# Altium project Conveyer_MainBoard.PrjPcb
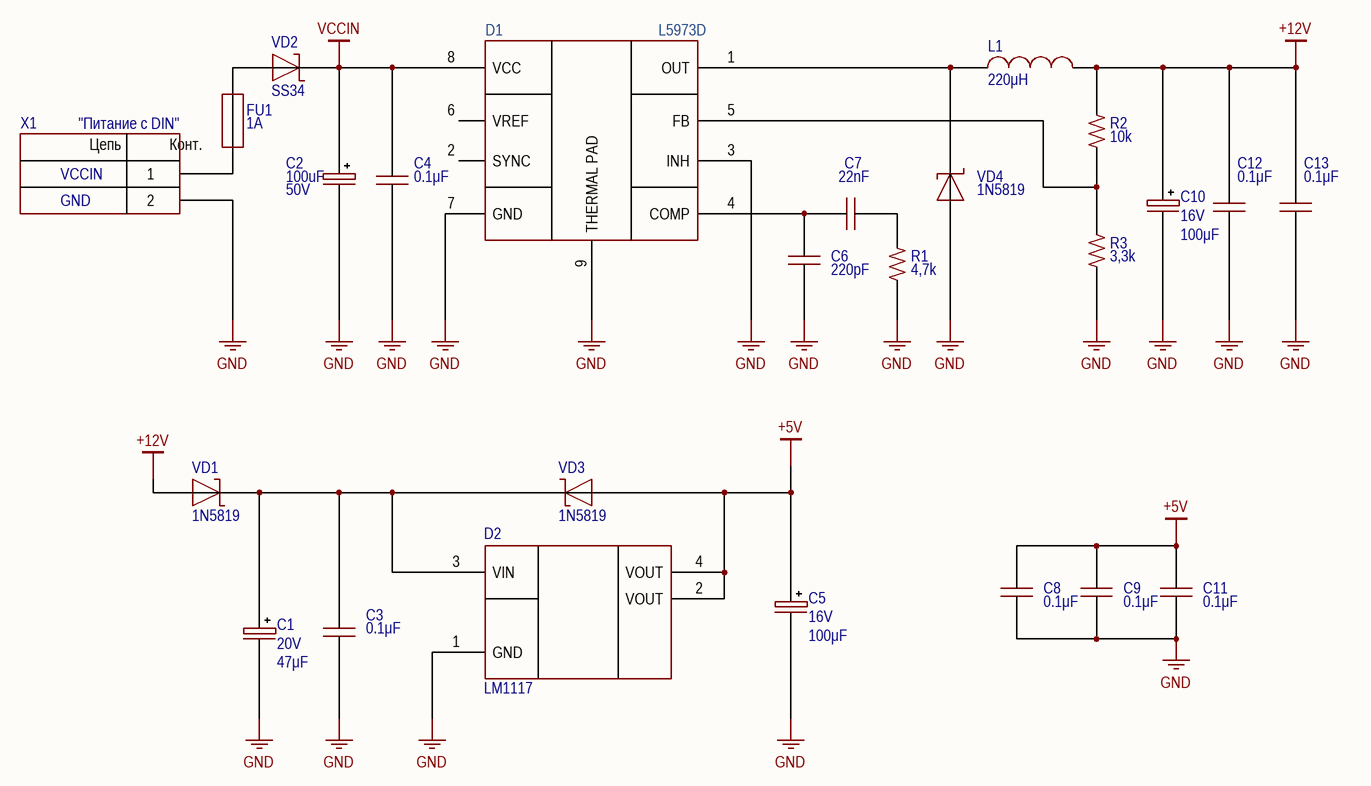
[diagram p0: Power.SchDoc]
3 sheets, 127 parts. Net scope: global (net labels, ports and power ports of the same name join across sheets).
Board file: PCB.PcbDoc
Sheets:
  Power.SchDoc
  Step_Driver.SchDoc
  Input.SchDoc

## Sheet Power.SchDoc
size 420 x 297 mm; Address1: Address1; Address2: Address2; Address3: Address3; Address4: Address4; DocumentNumber: АБВГ.123456.001 Э3; SheetNumber: 1; Scale: 1:1; DocumentType: Схема электрическая принципиальная; FirstReferrence: АБВГ.123456.001

### Parts
C1  Напряжение: 20V  Значение: 47μF  [CAP: TANTAL-D]
C2  value 100uF  Voltage: 50V  [CAP: SMD D8A6.9]
C3  value 0.1μF  [CAP: 0805]
C4  value 0.1μF  [CAP: 0805]
C5  Напряжение: 16V  Значение: 100μF  [CAP: TANTAL-D]
C6  value 220pF  [CAP: 0805]
C7  value 22nF  [CAP: 0805]
C8  value 0.1μF  [CAP: 0805]
C9  value 0.1μF  [CAP: 0805]
C10  Напряжение: 16V  Значение: 100μF  [CAP: TANTAL-D]
C11  value 0.1μF  [CAP: 0805]
C12  value 0.1μF  [CAP: 0805]
C13  value 0.1μF  [CAP: 0805]
D1  L5973D  [HSOIC-DDA-8]
D2  (no value)  [SOT223]
FU1  MaxCurrent: 1A  [FUSE: 1812]
L1  value 220μH  [IND: CD54]
R1  value 4,7k  [RES: 0805]
R2  value 10k  [RES: 0805]
R3  value 3,3k  [RES: 0805]
VD1  PartNumber: 1N5819  [DIODE: SOD123]
VD2  PartNumber: SS34  [DIODE: SMA]
VD3  PartNumber: 1N5819  [DIODE: SOD123]
VD4  PartNumber: 1N5819  [DIODE: SOD123]
X1  CommentText: "Питание с DIN"  [CON: 15EDGVC-3.5-02 (or 691321100002)]

### Nets
+5V: C5.1 C8.2 C9.2 C11.2 D2.2(VOUT) D2.4(VOUT) VD3.1
+12V: C10.1 C12.2 C13.2 L1.1 R2.1 VD1.1
GND: C1.2 C2.2 C3.1 C4.1 C5.2 C6.2 C8.1 C9.1 C10.2 C11.1 C12.1 C13.1 D1.3(INH) D1.7(GND) D1.9(THERMAL_PAD) D2.1(GND) R1.2 R3.2 VD4.1 X1.2
VCCIN: C2.1 C4.2 D1.8(VCC) VD2.2
NetC1_1: C1.1 C3.2 D2.3(VIN) VD1.2 VD3.2
NetC6_1: C6.1 C7.2 D1.4(COMP)
NetC7_1: C7.1 R1.1
NetD1_1: D1.1(OUT) L1.2 VD4.2
NetD1_5: D1.5(FB) R2.2 R3.1
NetFU1_1: FU1.1 X1.1
NetFU1_2: FU1.2 VD2.1

Not connected (* = marked no-connect by the designer): D1 2(SYNC) 6(VREF)

### Notes on the sheet
- GND
- VCCIN
- Перв. примен.
- Справ. №
- Подп. и дата
- Инв. № дубл.
- Взам. инв. №
- Разраб.
- Изм.
- Лист
- № докум.
- Подп.
- Дата
- Лит.
- Масса
- Масштаб
- Пров.
- Т.контр.
- Листов
- Инв. № подл.
- Утв.
- Н.контр.
- 2.106-A3
- Копировал
- Формат А3
- (in symbol Connector_terminal_2pin) Цепь; Конт.

### Library data of the parts
C1 C5 C10 = Танталы SMD: Производитель: AVX; УникальныйНомер: F930J107KAAAJ6; Типоразмер: Тип А (3216); Ссылка: ***; Точность: ±10%; ТипКомпонента: Tantalum capacitor
C2 = Aluminium: Manufacturer: Capxon International Elec; PartNumber: TH102M025I200ECAB; TypeCapacitor: Конденсатор электролитический алюминиевый SMD; Package: 13x20mm
C3 C8 C9 C11-C13 = Ceramic_0805: Manufacturer: Murata Electronics; PartNumber: GRM21BR71H104KA01L; ValueManufacturerPartNumber: Керамический конденсатор, 0.1μF, X7R, ±10%, 16V, 0805, -55...+125°C; TypeCapacitor: Керамический конденсатор; Tolerance: ±10%; TypeDielectric: X7R; Voltage: 16V; Package: 0805; HelpURL: https://www.digikey.com/product-detail/en/yageo/CC0805KRX7R7BB104/311-1142-1-ND/303052; Temperature: -55...+125°C
C4 = Ceramic_0805: Manufacturer: Murata Electronics; PartNumber: GRM21BR71H104KA01L; ValueManufacturerPartNumber: Керамический конденсатор, 0.1μF, X7R, ±10%, 50V, 0805, -55...+125°C; TypeCapacitor: Керамический конденсатор; Tolerance: ±10%; TypeDielectric: X7R; Voltage: 50V; Package: 0805; HelpURL: https://www.digikey.com/product-detail/en/yageo/CC0805KRX7R7BB104/311-1142-1-ND/303052; Temperature: -55...+125°C
C6 = Ceramic_0805: Manufacturer: Murata Electronics; PartNumber: GCJ21BR71H224KA01L; ValueManufacturerPartNumber: Керамический конденсатор, 220pF, X7R, ±10%, 16V, 0805, -55...+125°C; TypeCapacitor: Керамический конденсатор; Tolerance: ±10%; TypeDielectric: X7R; Voltage: 16V; Package: 0805; HelpURL: https://www.digikey.com/product-detail/en/yageo/CC0805KRX7R7BB104/311-1142-1-ND/303052; Temperature: -55...+125°C
C7 = Ceramic_0805: Manufacturer: Murata Electronics; PartNumber: GCM216R71H223KA37D; ValueManufacturerPartNumber: Керамический конденсатор, 22nF, X7R, ±10%, 16V, 0805, -55...+125°C; TypeCapacitor: Керамический конденсатор; Tolerance: ±10%; TypeDielectric: X7R; Voltage: 16V; Package: 0805; HelpURL: https://www.digikey.com/product-detail/en/yageo/CC0805KRX7R7BB104/311-1142-1-ND/303052; Temperature: -55...+125°C
D1 = L5973D: Импульсный понижающий регулятор напряжения; Manufacturer: STMicroelectronics; ValueManufacturerPartNumber: Импульсный понижающий регулятор напряжения, supply 10...30V, 500kHz, External switch, -40...+105°C, HSOP-8; PartNumber: L5973D013TR; VoltageInput: supply 10...30V; Frequency: 500kHz; OutputType: External switch; HelpURL: https://www.digikey.com/product-detail/en/on-semiconductor/UC3842BVD1R2G/UC3842BVD1R2GOSCT-ND/5802572; Package: HSOP-8; ComponentType: Импульсный понижающий регулятор напряжения; Temperature: -40...+105°C
D2 = LM1117: Линейный регулятор с низким падением напряжения; Manufacturer: STMicroelectronics; ValueManufacturerPartNumber: Линейный регулятор с низким падением напряжения, input 3.9...18V, 0.6V, output 3.3V, 1.2A, -40...+85°C, SOT223; VoltageInput: input 3.9...18V; MaxDropout: 0.6V; CurrentOutput: 1.2A; VoltageOutput: output 3.3V; HelpURL: ***; Package: SOT223; ComponentType: Линейный регулятор с низким падением напряжения; Temperature: -40...+85°C; PartNumber: LM1117
FU1 = Fuse: Manufacturer: Littelfuse; PartNumber: 0468001.NR; TypeFuse: Предохранитель SMD; VoltageMax: 250VAC; Package: 1206; HelpURL: https://www.digikey.com/products/en?keywords=01110501Z; ValueManufacturerPartNumber: =TypeFuse+', '+VoltageMax+', '+MaxCurrent+', '+Package+', '+Temperature
L1 = Inductor_CD54: Manufacturer: YJYCOIN; PartNumber: CD54YP0504-221M; ValueManufacturerPartNumber: Fixed inductor, 220μH, ±20%, CD54, 1.44A, -40...+100°C; TypeInductor: Fixed inductor; MaxCurrent: 1.44A; Tolerance: ±20%; Package: CD54; HelpURL: https://www.digikey.com/product-detail/en/sumida-america-components-inc/CD43NP-100MC/308-1855-1-ND/3925624; Temperature: -40...+100°C
R1 = Resistor_0805_ieee: Manufacturer: Vishay Intertech; PartNumber: CRCW08054K70JNEA; ValueManufacturerPartNumber: Резистор SMD, 4,7k, ±1%, 0805, 0.125W, -55...+125°C; TypeResistor: Резистор SMD; Power: 0.125W; Tolerance: ±1%; Package: 0805; HelpURL: https://www.digikey.com/product-detail/en/yageo/RC0805JR-07100RL/311-100ARCT-ND/731185; Temperature: -55...+125°C
R2 = Resistor_0805_ieee: Manufacturer: Vishay Intertech; PartNumber: CRCW080510K0FKEA; ValueManufacturerPartNumber: Резистор SMD, 10k, ±1%, 0805, 0.125W, -55...+125°C; TypeResistor: Резистор SMD; Power: 0.125W; Tolerance: ±1%; Package: 0805; HelpURL: https://www.digikey.com/product-detail/en/yageo/RC0805JR-07100RL/311-100ARCT-ND/731185; Temperature: -55...+125°C
R3 = Resistor_0805_ieee: Manufacturer: Vishay Intertech; ValueManufacturerPartNumber: Резистор SMD, 3,3k, ±1%, 0805, 0.125W, -55...+125°C; TypeResistor: Резистор SMD; Power: 0.125W; Tolerance: ±1%; PartNumber: Vishay Intertech; Package: 0805; HelpURL: https://www.digikey.com/product-detail/en/yageo/RC0805JR-07100RL/311-100ARCT-ND/731185; Temperature: -55...+125°C
VD1-VD3 = Schottky_single: Manufacturer: BORN; ValueManufacturerPartNumber: Диод Шоттки, 80V, 500mA, 1V, 15pF, SMA, -55...+150°C; TypeDiode: Диод Шоттки; Voltage: 80V; Current: 500mA; VoltageDrop: 1V; RecoveryTime: 15pF; Package: SMA; HelpURL: https://www.digikey.com/product-detail/en/diodes-incorporated/MBR0580S1-7/MBR0580S1-7DICT-ND/5080371; Temperature: -55...+150°C
VD4 = Schottky_single: Manufacturer: Diodes Incorporated; ValueManufacturerPartNumber: Диод Шоттки, 80V, 500mA, 1V, 15pF, SOD-123, -55...+150°C; TypeDiode: Диод Шоттки; Voltage: 80V; Current: 500mA; VoltageDrop: 1V; RecoveryTime: 15pF; Package: SOD-123; HelpURL: https://www.digikey.com/product-detail/en/diodes-incorporated/MBR0580S1-7/MBR0580S1-7DICT-ND/5080371; Temperature: -55...+150°C
X1 = Connector_terminal_2pin: Manufacturer: DEGSON; ValueManufacturerPartNumber: Клеммник, 2pin, 3.5mm, 300VAC, 10A; PartNumber: DG350-3.5-02P-14-00A(H); TypeConnector: Клеммник; VoltageMax: 300VAC; Pitch: 3.5mm; CurrentMax: 10A; Multichannel: 2pin; HelpURL: https://www.chipdip.ru/product/dg350-3.5-02p-12

## Sheet Step_Driver.SchDoc
size 420 x 297 mm; Address1: Address1; Address2: Address2; Address3: Address3; Address4: Address4; DocumentNumber: АБВГ.123456.001 Э3; SheetNumber: 1; Scale: 1:1; DocumentType: Схема электрическая принципиальная; FirstReferrence: АБВГ.123456.001
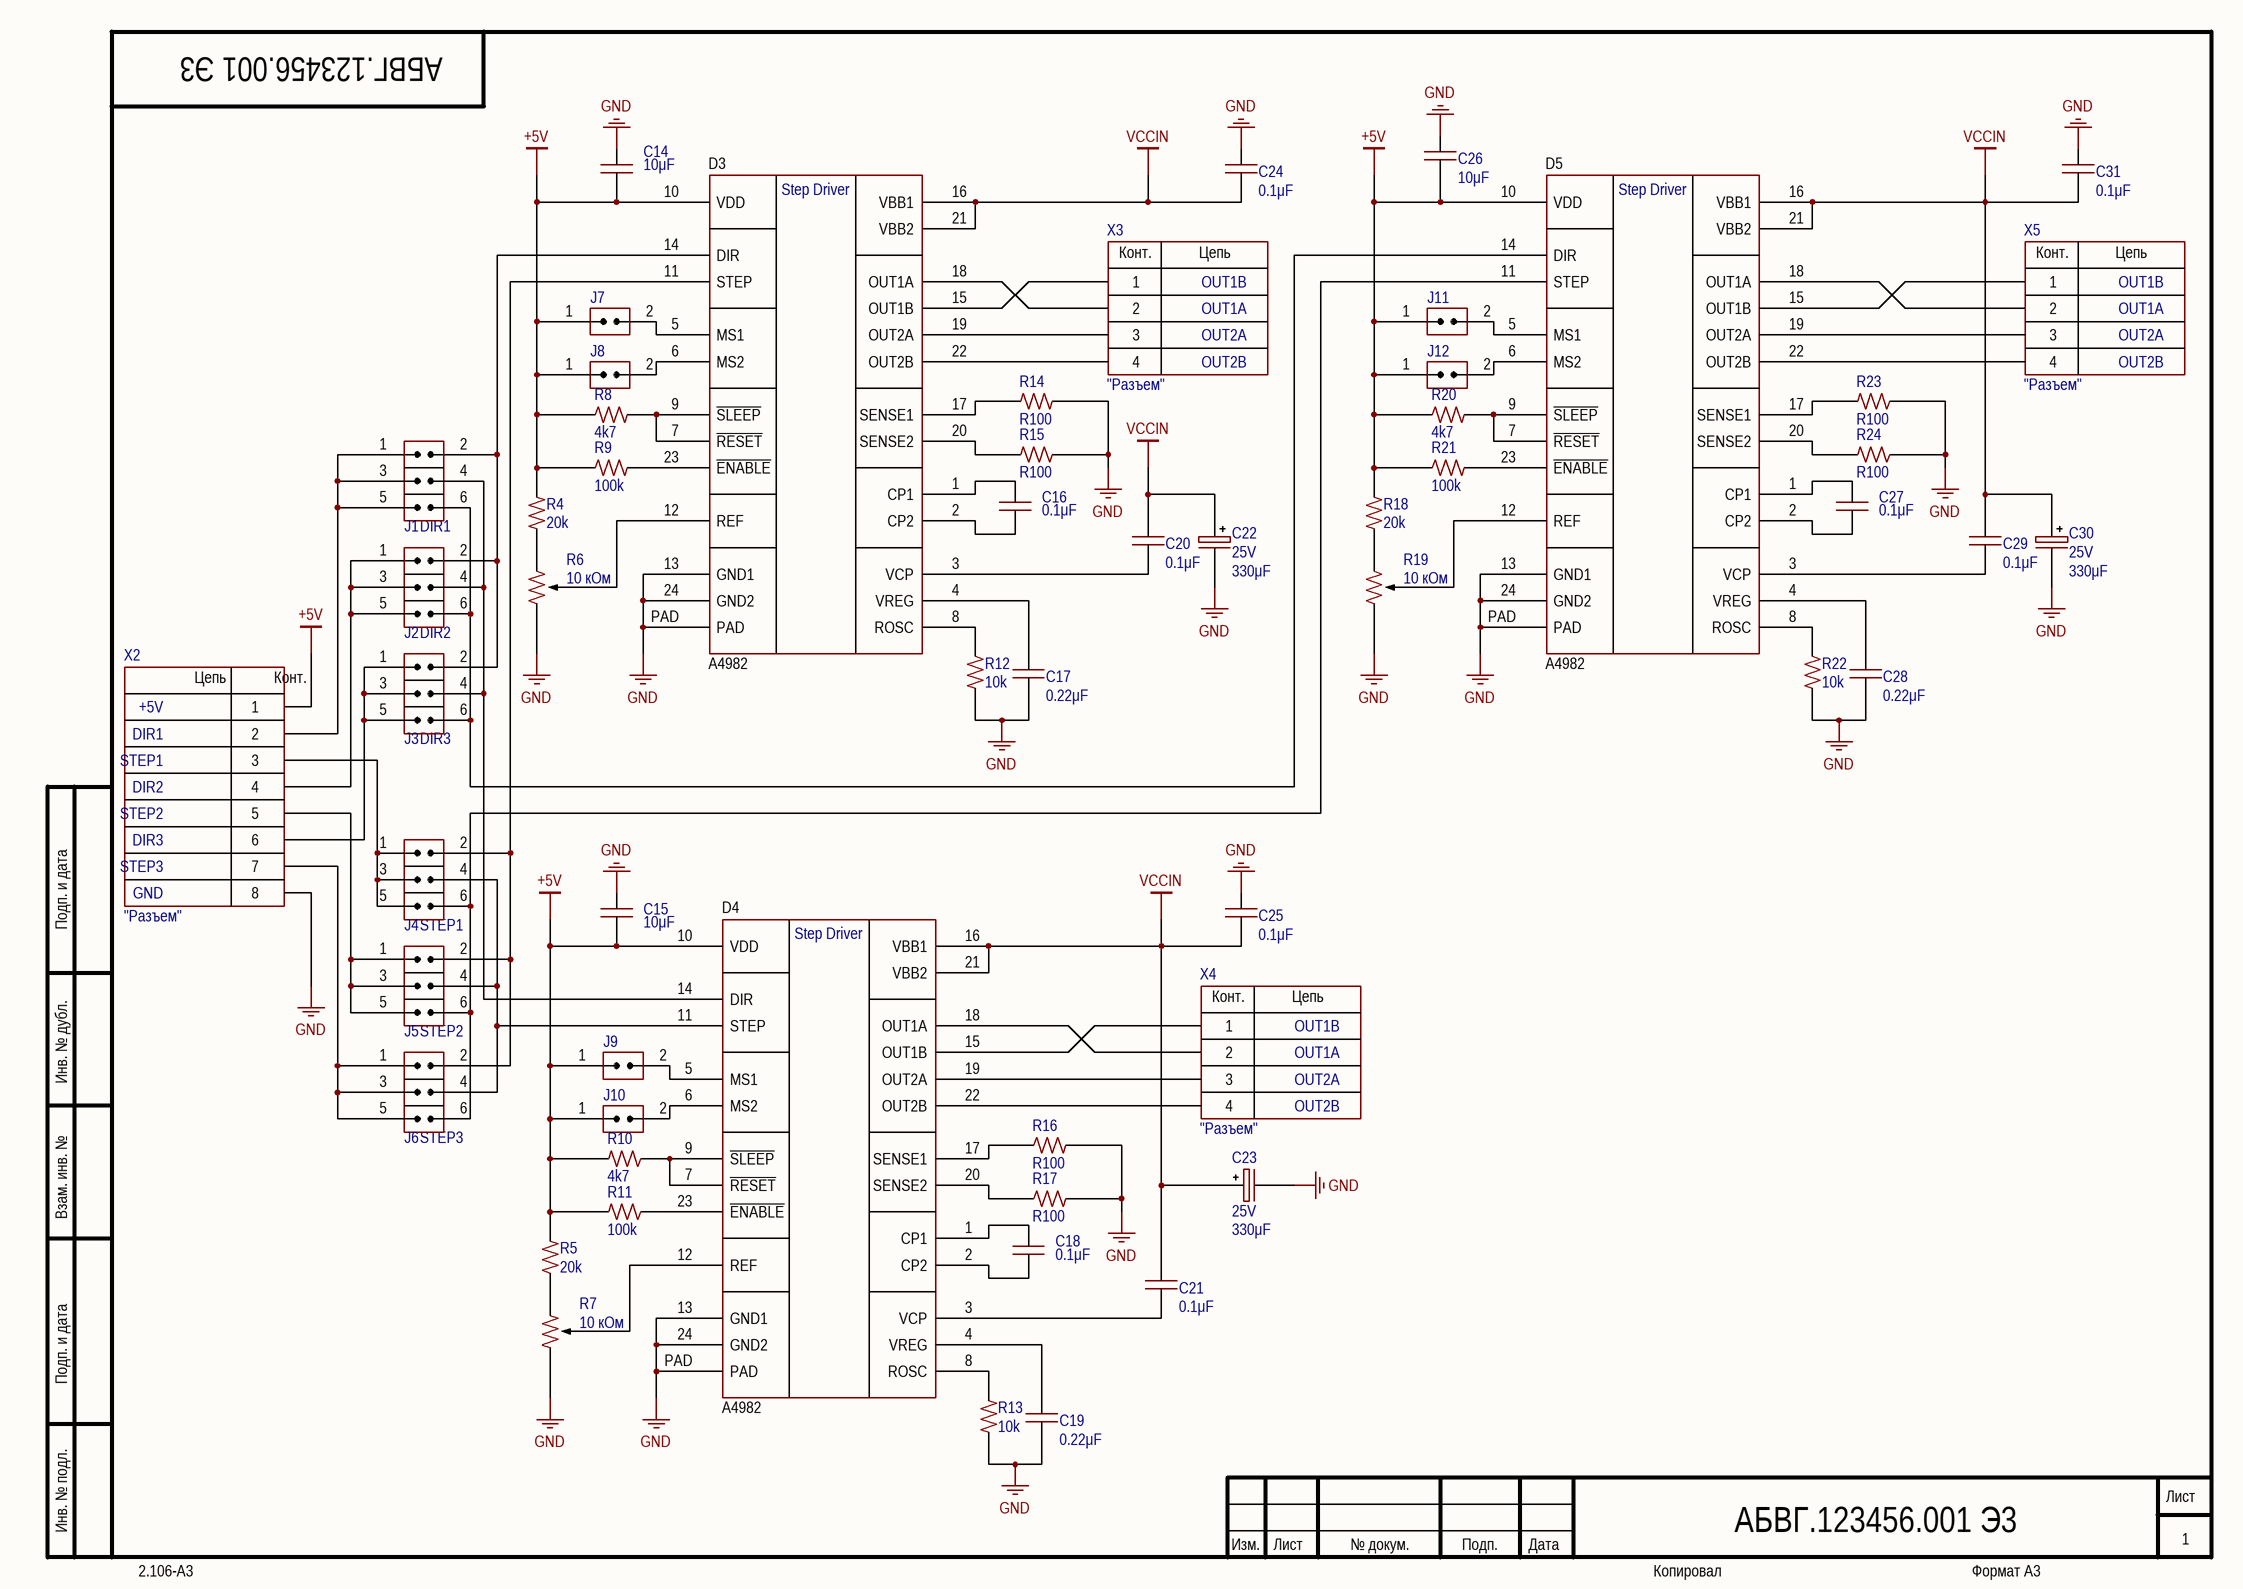
[diagram p1: Step_Driver.SchDoc]

### Parts
C14  Значение: 10μF  [CAP: 0805]  (hidden comment: Керамический SMD)
C15  Значение: 10μF  [CAP: 0805]  (hidden comment: Керамический SMD)
C16  Значение: 0.1μF  [CAP: 0805]  (hidden comment: Керамический SMD)
C17  Значение: 0.22μF  [CAP: 0805]  (hidden comment: Керамический SMD)
C18  Значение: 0.1μF  [CAP: 0805]  (hidden comment: Керамический SMD)
C19  Значение: 0.22μF  [CAP: 0805]  (hidden comment: Керамический SMD)
C20  Значение: 0.1μF  [CAP: 0805]  (hidden comment: Керамический SMD)
C21  Значение: 0.1μF  [CAP: 0805]  (hidden comment: Керамический SMD)
C22  Напряжение: 25V  Значение: 330μF  [CAP: SMD D6.3A6.6H7.7]
C23  Напряжение: 25V  Значение: 330μF  [CAP: SMD D6.3A6.6H7.7]
C24  Значение: 0.1μF  [CAP: 0805]  (hidden comment: Керамический SMD)
C25  Значение: 0.1μF  [CAP: 0805]  (hidden comment: Керамический SMD)
C26  Значение: 10μF  [CAP: 0805]  (hidden comment: Керамический SMD)
C27  Значение: 0.1μF  [CAP: 0805]  (hidden comment: Керамический SMD)
C28  Значение: 0.22μF  [CAP: 0805]  (hidden comment: Керамический SMD)
C29  Значение: 0.1μF  [CAP: 0805]  (hidden comment: Керамический SMD)
C30  Напряжение: 25V  Значение: 330μF  [CAP: SMD D6.3A6.6H7.7]
C31  Значение: 0.1μF  [CAP: 0805]  (hidden comment: Керамический SMD)
D3  A4982  [24-TSSOP-PAD]
D4  A4982  [24-TSSOP-PAD]
D5  A4982  [24-TSSOP-PAD]
J1  CommentText: DIR1  [CON: JUMPER x3]
J2  CommentText: DIR2  [CON: JUMPER x3]
J3  CommentText: DIR3  [CON: JUMPER x3]
J4  CommentText: STEP1  [CON: JUMPER x3]
J5  CommentText: STEP2  [CON: JUMPER x3]
J6  CommentText: STEP3  [CON: JUMPER x3]
J7  (no value)  [CON: JUMPER x1]
J8  (no value)  [CON: JUMPER x1]
J9  (no value)  [CON: JUMPER x1]
J10  (no value)  [CON: JUMPER x1]
J11  (no value)  [CON: JUMPER x1]
J12  (no value)  [CON: JUMPER x1]
R4  Значение: 20k  [RES: 0805]  (hidden comment: Резистор SMD)
R5  Значение: 20k  [RES: 0805]  (hidden comment: Резистор SMD)
R6  Значение: 10 кОм  [RES: 3296W]  (hidden comment: Резистор подстроечный)
R7  Значение: 10 кОм  [RES: 3296W]  (hidden comment: Резистор подстроечный)
R8  Значение: 4k7  [RES: 0805]  (hidden comment: Резистор SMD)
R9  Значение: 100k  [RES: 0805]  (hidden comment: Резистор SMD)
R10  Значение: 4k7  [RES: 0805]  (hidden comment: Резистор SMD)
R11  Значение: 100k  [RES: 0805]  (hidden comment: Резистор SMD)
R12  Значение: 10k  [RES: 0805]  (hidden comment: Резистор SMD)
R13  Значение: 10k  [RES: 0805]  (hidden comment: Резистор SMD)
R14  Значение: R100  [RES: 2010]  (hidden comment: Резистор SMD)
R15  Значение: R100  [RES: 2010]  (hidden comment: Резистор SMD)
R16  Значение: R100  [RES: 2010]  (hidden comment: Резистор SMD)
R17  Значение: R100  [RES: 2010]  (hidden comment: Резистор SMD)
R18  Значение: 20k  [RES: 0805]  (hidden comment: Резистор SMD)
R19  Значение: 10 кОм  [RES: 3296W]  (hidden comment: Резистор подстроечный)
R20  Значение: 4k7  [RES: 0805]  (hidden comment: Резистор SMD)
R21  Значение: 100k  [RES: 0805]  (hidden comment: Резистор SMD)
R22  Значение: 10k  [RES: 0805]  (hidden comment: Резистор SMD)
R23  Значение: R100  [RES: 2010]  (hidden comment: Резистор SMD)
R24  Значение: R100  [RES: 2010]  (hidden comment: Резистор SMD)
X2  CommentText: "Разъем"  [CON: PLS-8]
X3  CommentText: "Разъем"  [CON: 15EDGVC-3.5-04]
X4  CommentText: "Разъем"  [CON: 15EDGVC-3.5-04]
X5  CommentText: "Разъем"  [CON: 15EDGVC-3.5-04]

### Nets
+5V: C14.1 C15.1 C26.1 D3.10(VDD) D4.10(VDD) D5.10(VDD) J7.1(IN) J8.1(IN) J9.1(IN) J10.1(IN) J11.1(IN) J12.1(IN) R4.2 R5.2 R8.1 R9.1 R10.1 R11.1 R18.2 R20.1 R21.1 X2.1
GND: C14.2 C15.2 C17.1 C19.1 C22.2 C23.2 C24.1 C25.1 C26.2 C28.1 C30.2 C31.1 D3.13(GND1) D3.24(GND2) D3.PAD D4.13(GND1) D4.24(GND2) D4.PAD D5.13(GND1) D5.24(GND2) D5.PAD R6.3 R7.3 R12.1 R13.1 R14.2 R15.2 R16.2 R17.2 R19.3 R22.1 R23.2 R24.2 X2.8
VCCIN: C20.2 C21.2 C22.1 C23.1 C24.2 C25.2 C29.2 C30.1 C31.2 D3.16(VBB1) D3.21(VBB2) D4.16(VBB1) D4.21(VBB2) D5.16(VBB1) D5.21(VBB2)
NetC16_1: C16.1 D3.2(CP2)
NetC16_2: C16.2 D3.1(CP1)
NetC17_2: C17.2 D3.4(VREG)
NetC18_1: C18.1 D4.2(CP2)
NetC18_2: C18.2 D4.1(CP1)
NetC19_2: C19.2 D4.4(VREG)
NetC20_1: C20.1 D3.3(VCP)
NetC21_1: C21.1 D4.3(VCP)
NetC27_1: C27.1 D5.2(CP2)
NetC27_2: C27.2 D5.1(CP1)
NetC28_2: C28.2 D5.4(VREG)
NetC29_1: C29.1 D5.3(VCP)
NetD3_5: D3.5(MS1) J7.2(IN)
NetD3_6: D3.6(MS2) J8.2(IN)
NetD3_7: D3.7(~{RESET}) D3.9(~{SLEEP}) R8.2
NetD3_8: D3.8(ROSC) R12.2
NetD3_11: D3.11(STEP) J4.2(IN) J5.2(IN) J6.2(IN)
NetD3_12: D3.12(REF) R6.2
NetD3_14: D3.14(DIR) J1.2(IN) J2.2(IN) J3.2(IN)
NetD3_15: D3.15(OUT1B) X3.1
NetD3_17: D3.17(SENSE1) R14.1
NetD3_18: D3.18(OUT1A) X3.2
NetD3_19: D3.19(OUT2A) X3.3
NetD3_20: D3.20(SENSE2) R15.1
NetD3_22: D3.22(OUT2B) X3.4
NetD3_23: D3.23(~{ENABLE}) R9.2
NetD4_5: D4.5(MS1) J9.2(IN)
NetD4_6: D4.6(MS2) J10.2(IN)
NetD4_7: D4.7(~{RESET}) D4.9(~{SLEEP}) R10.2
NetD4_8: D4.8(ROSC) R13.2
NetD4_11: D4.11(STEP) J4.4(IN) J5.4(IN) J6.4(IN)
NetD4_12: D4.12(REF) R7.2
NetD4_14: D4.14(DIR) J1.4(IN) J2.4(IN) J3.4(IN)
NetD4_15: D4.15(OUT1B) X4.1
NetD4_17: D4.17(SENSE1) R16.1
NetD4_18: D4.18(OUT1A) X4.2
NetD4_19: D4.19(OUT2A) X4.3
NetD4_20: D4.20(SENSE2) R17.1
NetD4_22: D4.22(OUT2B) X4.4
NetD4_23: D4.23(~{ENABLE}) R11.2
NetD5_5: D5.5(MS1) J11.2(IN)
NetD5_6: D5.6(MS2) J12.2(IN)
NetD5_7: D5.7(~{RESET}) D5.9(~{SLEEP}) R20.2
NetD5_8: D5.8(ROSC) R22.2
NetD5_11: D5.11(STEP) J4.6(IN) J5.6(IN) J6.6(IN)
NetD5_12: D5.12(REF) R19.2
NetD5_14: D5.14(DIR) J1.6(IN) J2.6(IN) J3.6(IN)
NetD5_15: D5.15(OUT1B) X5.1
NetD5_17: D5.17(SENSE1) R23.1
NetD5_18: D5.18(OUT1A) X5.2
NetD5_19: D5.19(OUT2A) X5.3
NetD5_20: D5.20(SENSE2) R24.1
NetD5_22: D5.22(OUT2B) X5.4
NetD5_23: D5.23(~{ENABLE}) R21.2
NetJ1_1: J1.1(IN) J1.3(IN) J1.5(IN) X2.2
NetJ2_1: J2.1(IN) J2.3(IN) J2.5(IN) X2.4
NetJ3_1: J3.1(IN) J3.3(IN) J3.5(IN) X2.6
NetJ4_1: J4.1(IN) J4.3(IN) J4.5(IN) X2.3
NetJ5_1: J5.1(IN) J5.3(IN) J5.5(IN) X2.5
NetJ6_1: J6.1(IN) J6.3(IN) J6.5(IN) X2.7
NetR4_1: R4.1 R6.1
NetR5_1: R5.1 R7.1
NetR18_1: R18.1 R19.1

### Notes on the sheet
- OUT1B
- OUT1A
- OUT2A
- OUT2B
- +5V
- DIR1
- STEP1
- DIR2
- STEP2
- DIR3
- STEP3
- GND
- Подп. и дата
- Инв. № дубл.
- Взам. инв. №
- Инв. № подл.
- Изм.
- Лист
- № докум.
- Подп.
- Дата
- 2.106-A3
- Копировал
- Формат А3
- (in symbol A4982) Step Driver
- (in symbol Connector_terminal_4pin) Конт.; Цепь
- (in symbol PLS-8) Цепь; Конт.

### Library data of the parts
C14-C21 C24-C29 C31 = Керамический SMD: Производитель: Yageo; УникальныйНомер: CC0201KRX7R7BB103; Типоразмер: 0201; Ссылка: ***; ТипКомпонента: Ceramic capacitor; Точность: ±10%; ТипДиэлектрика: X7R; Напряжение: 16V
C22 C23 C30 = Алюминиевые: Производитель: Wurth; УникальныйНомер: 860080475013; Типоразмер: 14x10x5 mm; Ссылка: ***; ТипКомпонента: Aluminium capacitor; Точность: ±20%
D3-D5 = A4982: Драйвер шагового двигателя; Производитель: UMW(Youtai Semiconductor Co., Ltd.); Ссылка: ***; Типоразмер: SOIC 8; ТипКомпонента: Battery Charger; УникальныйНомер: A4982
J1-J6 = Jumper_6_pin
J7-J12 = Jumper_2_pin: CommentText: "Перемычка"
R4 R5 R8-R18 R20-R24 = Резистор SMD: Производитель: YAGEO; УникальныйНомер: RC0201JR-07100RL; Типоразмер: 0201; Ссылка: ***; Точность: ±5%; ТипКомпонента: Резистор SMD
R6 R7 R19 = Резистор подстроечный: Производитель: Bourns; УникальныйНомер: 3296W-1-103LF; Типоразмер: 3296W; Ссылка: ***; ТипКомпонента: Resistor film; Точность: ±10%
X2 = PLS-8: Manufacturer: Connfly; ValueManufacturerPartNumber: Connector, 8pin, 2.54mm, 500VAC, 3A; TypeConnector: Connector; VoltageMax: 500VAC; Pitch: 2.54mm; CurrentMax: 3A; Multichannel: 8pin; HelpURL: https://www.chipdip.ru/product/pls-8-ds1021-1-8sf112; PartNumber: PLS-8
X3-X5 = Connector_terminal_4pin: Manufacturer: Degson; ValueManufacturerPartNumber: Terminal connector, 6pin, 3.5mm, 300VAC, 10A; PartNumber: DG350-3.5-06P-14; TypeConnector: Terminal connector; VoltageMax: 300VAC; Pitch: 3.5mm; CurrentMax: 10A; Multichannel: 6pin; HelpURL: https://www.compel.ru/infosheet/DEGSON/DG350-3.5-06P-14-00AH

## Sheet Input.SchDoc
size 420 x 297 mm; Address1: Address1; Address2: Address2; Address3: Address3; Address4: Address4; DocumentNumber: АБВГ.123456.001 Э3; SheetNumber: 1; Scale: 1:1; DocumentType: Схема электрическая принципиальная; FirstReferrence: АБВГ.123456.001
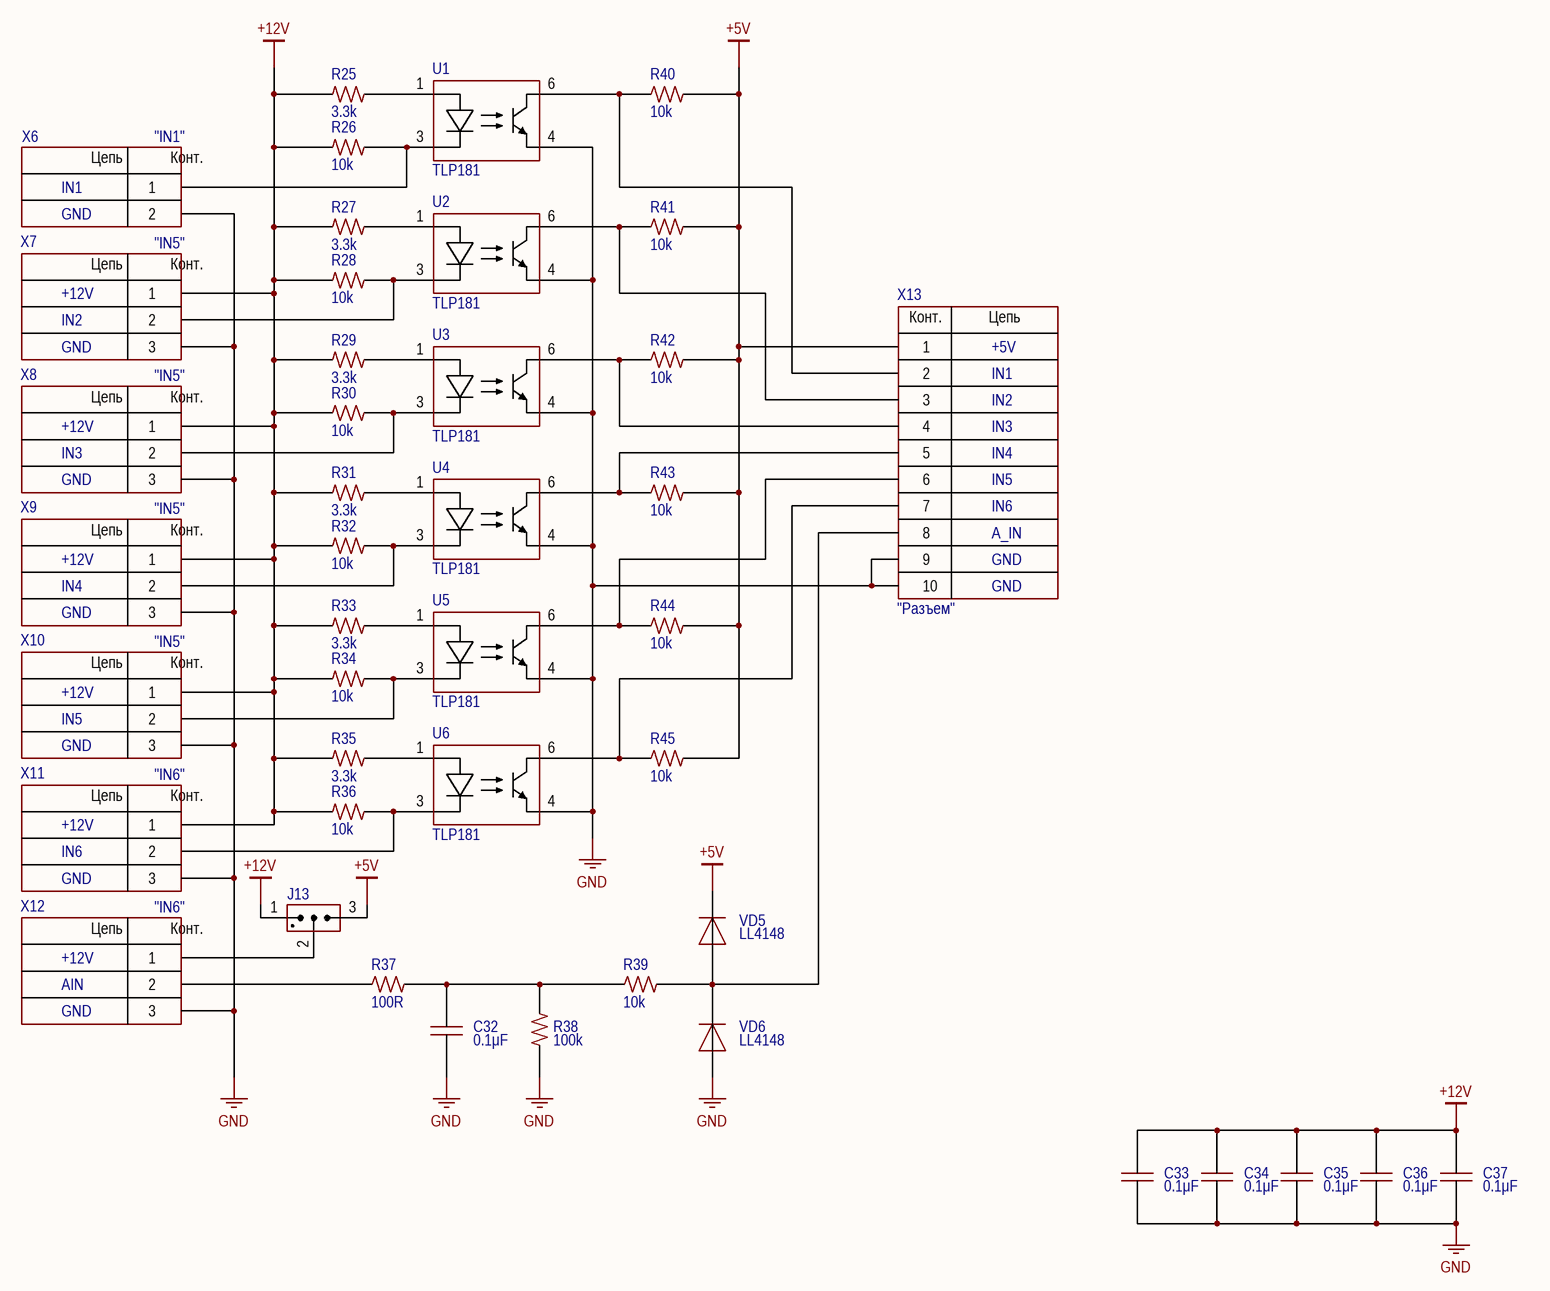
[diagram p2: Input.SchDoc]

### Parts
C32  value 0.1μF  [CAP: 0805]
C33  value 0.1μF  [CAP: 0805]
C34  value 0.1μF  [CAP: 0805]
C35  value 0.1μF  [CAP: 0805]
C36  value 0.1μF  [CAP: 0805]
C37  value 0.1μF  [CAP: 0805]
J13  (no value)  [CON: PLS-3]
R25  Значение: 3.3k  [RES: 0805]  (hidden comment: Резистор SMD)
R26  Значение: 10k  [RES: 0805]  (hidden comment: Резистор SMD)
R27  Значение: 3.3k  [RES: 0805]  (hidden comment: Резистор SMD)
R28  Значение: 10k  [RES: 0805]  (hidden comment: Резистор SMD)
R29  Значение: 3.3k  [RES: 0805]  (hidden comment: Резистор SMD)
R30  Значение: 10k  [RES: 0805]  (hidden comment: Резистор SMD)
R31  Значение: 3.3k  [RES: 0805]  (hidden comment: Резистор SMD)
R32  Значение: 10k  [RES: 0805]  (hidden comment: Резистор SMD)
R33  Значение: 3.3k  [RES: 0805]  (hidden comment: Резистор SMD)
R34  Значение: 10k  [RES: 0805]  (hidden comment: Резистор SMD)
R35  Значение: 3.3k  [RES: 0805]  (hidden comment: Резистор SMD)
R36  Значение: 10k  [RES: 0805]  (hidden comment: Резистор SMD)
R37  Значение: 100R  [RES: 0805]  (hidden comment: Резистор SMD)
R38  Значение: 100k  [RES: 0805]  (hidden comment: Резистор SMD)
R39  Значение: 10k  [RES: 0805]  (hidden comment: Резистор SMD)
R40  Значение: 10k  [RES: 0805]  (hidden comment: Резистор SMD)
R41  Значение: 10k  [RES: 0805]  (hidden comment: Резистор SMD)
R42  Значение: 10k  [RES: 0805]  (hidden comment: Резистор SMD)
R43  Значение: 10k  [RES: 0805]  (hidden comment: Резистор SMD)
R44  Значение: 10k  [RES: 0805]  (hidden comment: Резистор SMD)
R45  Значение: 10k  [RES: 0805]  (hidden comment: Резистор SMD)
U1  (no value)  [OPTO: TLP181]
U2  (no value)  [OPTO: TLP181]
U3  (no value)  [OPTO: TLP181]
U4  (no value)  [OPTO: TLP181]
U5  (no value)  [OPTO: TLP181]
U6  (no value)  [OPTO: TLP181]
VD5  PartNumber: LL4148  [DIODE: SOD80]
VD6  PartNumber: LL4148  [DIODE: SOD80]
X6  CommentText: "IN1"  [CON: 15EDGVC-3.5-02 (or 691321100002)]
X7  CommentText: "IN5"  [CON: 15EDGVC-3.5-03 (or 691321100003)]
X8  CommentText: "IN5"  [CON: 15EDGVC-3.5-03 (or 691321100003)]
X9  CommentText: "IN5"  [CON: 15EDGVC-3.5-03 (or 691321100003)]
X10  CommentText: "IN5"  [CON: 15EDGVC-3.5-03 (or 691321100003)]
X11  CommentText: "IN6"  [CON: 15EDGVC-3.5-03 (or 691321100003)]
X12  CommentText: "IN6"  [CON: 15EDGVC-3.5-03 (or 691321100003)]
X13  CommentText: "Разъем"  [CON: PLS-10]

### Nets
+5V: J13.3(IN) R40.2 R41.2 R42.2 R43.2 R44.2 R45.2 VD5.2 X13.1
+12V: C33.2 C34.2 C35.2 C36.2 C37.2 J13.1(IN) R25.1 R26.1 R27.1 R28.1 R29.1 R30.1 R31.1 R32.1 R33.1 R34.1 R35.1 R36.1 X7.1 X8.1 X9.1 X10.1 X11.1
GND: C32.1 C33.1 C34.1 C35.1 C36.1 C37.1 R38.1 U1.4(E) U2.4(E) U3.4(E) U4.4(E) U5.4(E) U6.4(E) VD6.1 X6.2 X7.3 X8.3 X9.3 X10.3 X11.3 X12.3 X13.9 X13.10
NetC32_2: C32.2 R37.2 R38.2 R39.1
NetJ13_2: J13.2(IN) X12.1
NetR25_2: R25.2 U1.1(A)
NetR26_2: R26.2 U1.3(C) X6.1
NetR27_2: R27.2 U2.1(A)
NetR28_2: R28.2 U2.3(C) X7.2
NetR29_2: R29.2 U3.1(A)
NetR30_2: R30.2 U3.3(C) X8.2
NetR31_2: R31.2 U4.1(A)
NetR32_2: R32.2 U4.3(C) X9.2
NetR33_2: R33.2 U5.1(A)
NetR34_2: R34.2 U5.3(C) X10.2
NetR35_2: R35.2 U6.1(A)
NetR36_2: R36.2 U6.3(C) X11.2
NetR37_1: R37.1 X12.2
NetR39_2: R39.2 VD5.1 VD6.2 X13.8
NetR40_1: R40.1 U1.6(C) X13.2
NetR41_1: R41.1 U2.6(C) X13.3
NetR42_1: R42.1 U3.6(C) X13.4
NetR43_1: R43.1 U4.6(C) X13.5
NetR44_1: R44.1 U5.6(C) X13.6
NetR45_1: R45.1 U6.6(C) X13.7

### Notes on the sheet
- GND
- IN1
- +12V
- IN2
- +5V
- IN3
- IN4
- IN5
- IN6
- A_IN
- AIN
- Подп. и дата
- Инв. № дубл.
- Взам. инв. №
- Инв. № подл.
- Изм.
- Лист
- № докум.
- Подп.
- Дата
- 2.106-A3
- Копировал
- Формат А3
- (in symbol Connector_terminal_2pin) Цепь; Конт.
- (in symbol Connector_terminal_3pin) Цепь; Конт.
- (in symbol PLS-10) Конт.; Цепь

### Library data of the parts
C32-C37 = Ceramic_0805: as C3 on sheet Power; Package: 0805; HelpURL: https://www.digikey.com/product-detail/en/yageo/CC0805KRX7R7BB104/311-1142-1-ND/303052; Temperature: -55...+125°C
J13 = Jumper_3_pin: CommentText: "Перемычка"
R25-R45 = Резистор SMD: as R4 on sheet Step_Driver; ТипКомпонента: Резистор SMD
U1-U6 = TLP181: Optoisolator; Manufacturer: Toshiba; Supply: 80V; DataRate: 4µs/3µs; Isolation: 3750Vrms; Package: 11-4c1; ComponentType: IC optoisolator; Temperature: -40...+125°C; PartNumber: TLP181
VD5 VD6 = Diode_single: Manufacturer: Micro Commercial; ValueManufacturerPartNumber: Single diode, 75V, 150mA, 1V, 4ns, SOD-323, -55...+150°C; TypeDiode: Single diode; Voltage: 75V; Current: 150mA; VoltageDrop: 1V; RecoveryTime: 4ns; Package: SOD-323; HelpURL: https://www.digikey.com/product-detail/en/micro-commercial-co/1N4148WX-TP/1N4148WXTPMSCT-ND/717312; Temperature: -55...+150°C
X6 = Connector_terminal_2pin: as X1 on sheet Power; HelpURL: https://www.chipdip.ru/product/dg350-3.5-02p-12
X7-X12 = Connector_terminal_3pin: Manufacturer: Degson; ValueManufacturerPartNumber: Terminal connector, 3pin, 3.5mm, 300VAC, 10A; PartNumber: DG350-3.5-03P-14; TypeConnector: Terminal connector; VoltageMax: 300VAC; Pitch: 3.5mm; CurrentMax: 10A; Multichannel: 3pin; HelpURL: https://www.chipdip.ru/product/dg350-3.5-03p-12
X13 = PLS-10: Manufacturer: Connfly; ValueManufacturerPartNumber: Connector, 10pin, 2.54mm, 500VAC, 3A; TypeConnector: Connector; VoltageMax: 500VAC; Pitch: 2.54mm; CurrentMax: 3A; Multichannel: 10pin; HelpURL: https://www.chipdip.ru/product/pls-10; PartNumber: PLS-10

## Nets that join several sheets
+5V: Power (7 pins), Step_Driver (22 pins), Input (9 pins)
+12V: Power (6 pins), Input (23 pins)
GND: Power (20 pins), Step_Driver (34 pins), Input (23 pins)
VCCIN: Power (C2.1 C4.2 D1.8 VD2.2), Step_Driver (15 pins)